# Altium schematic sheet ethernet.SchDoc (part 1 of 3)
size 420 x 297 mm; SheetNumber: 2; SheetTotal: 2
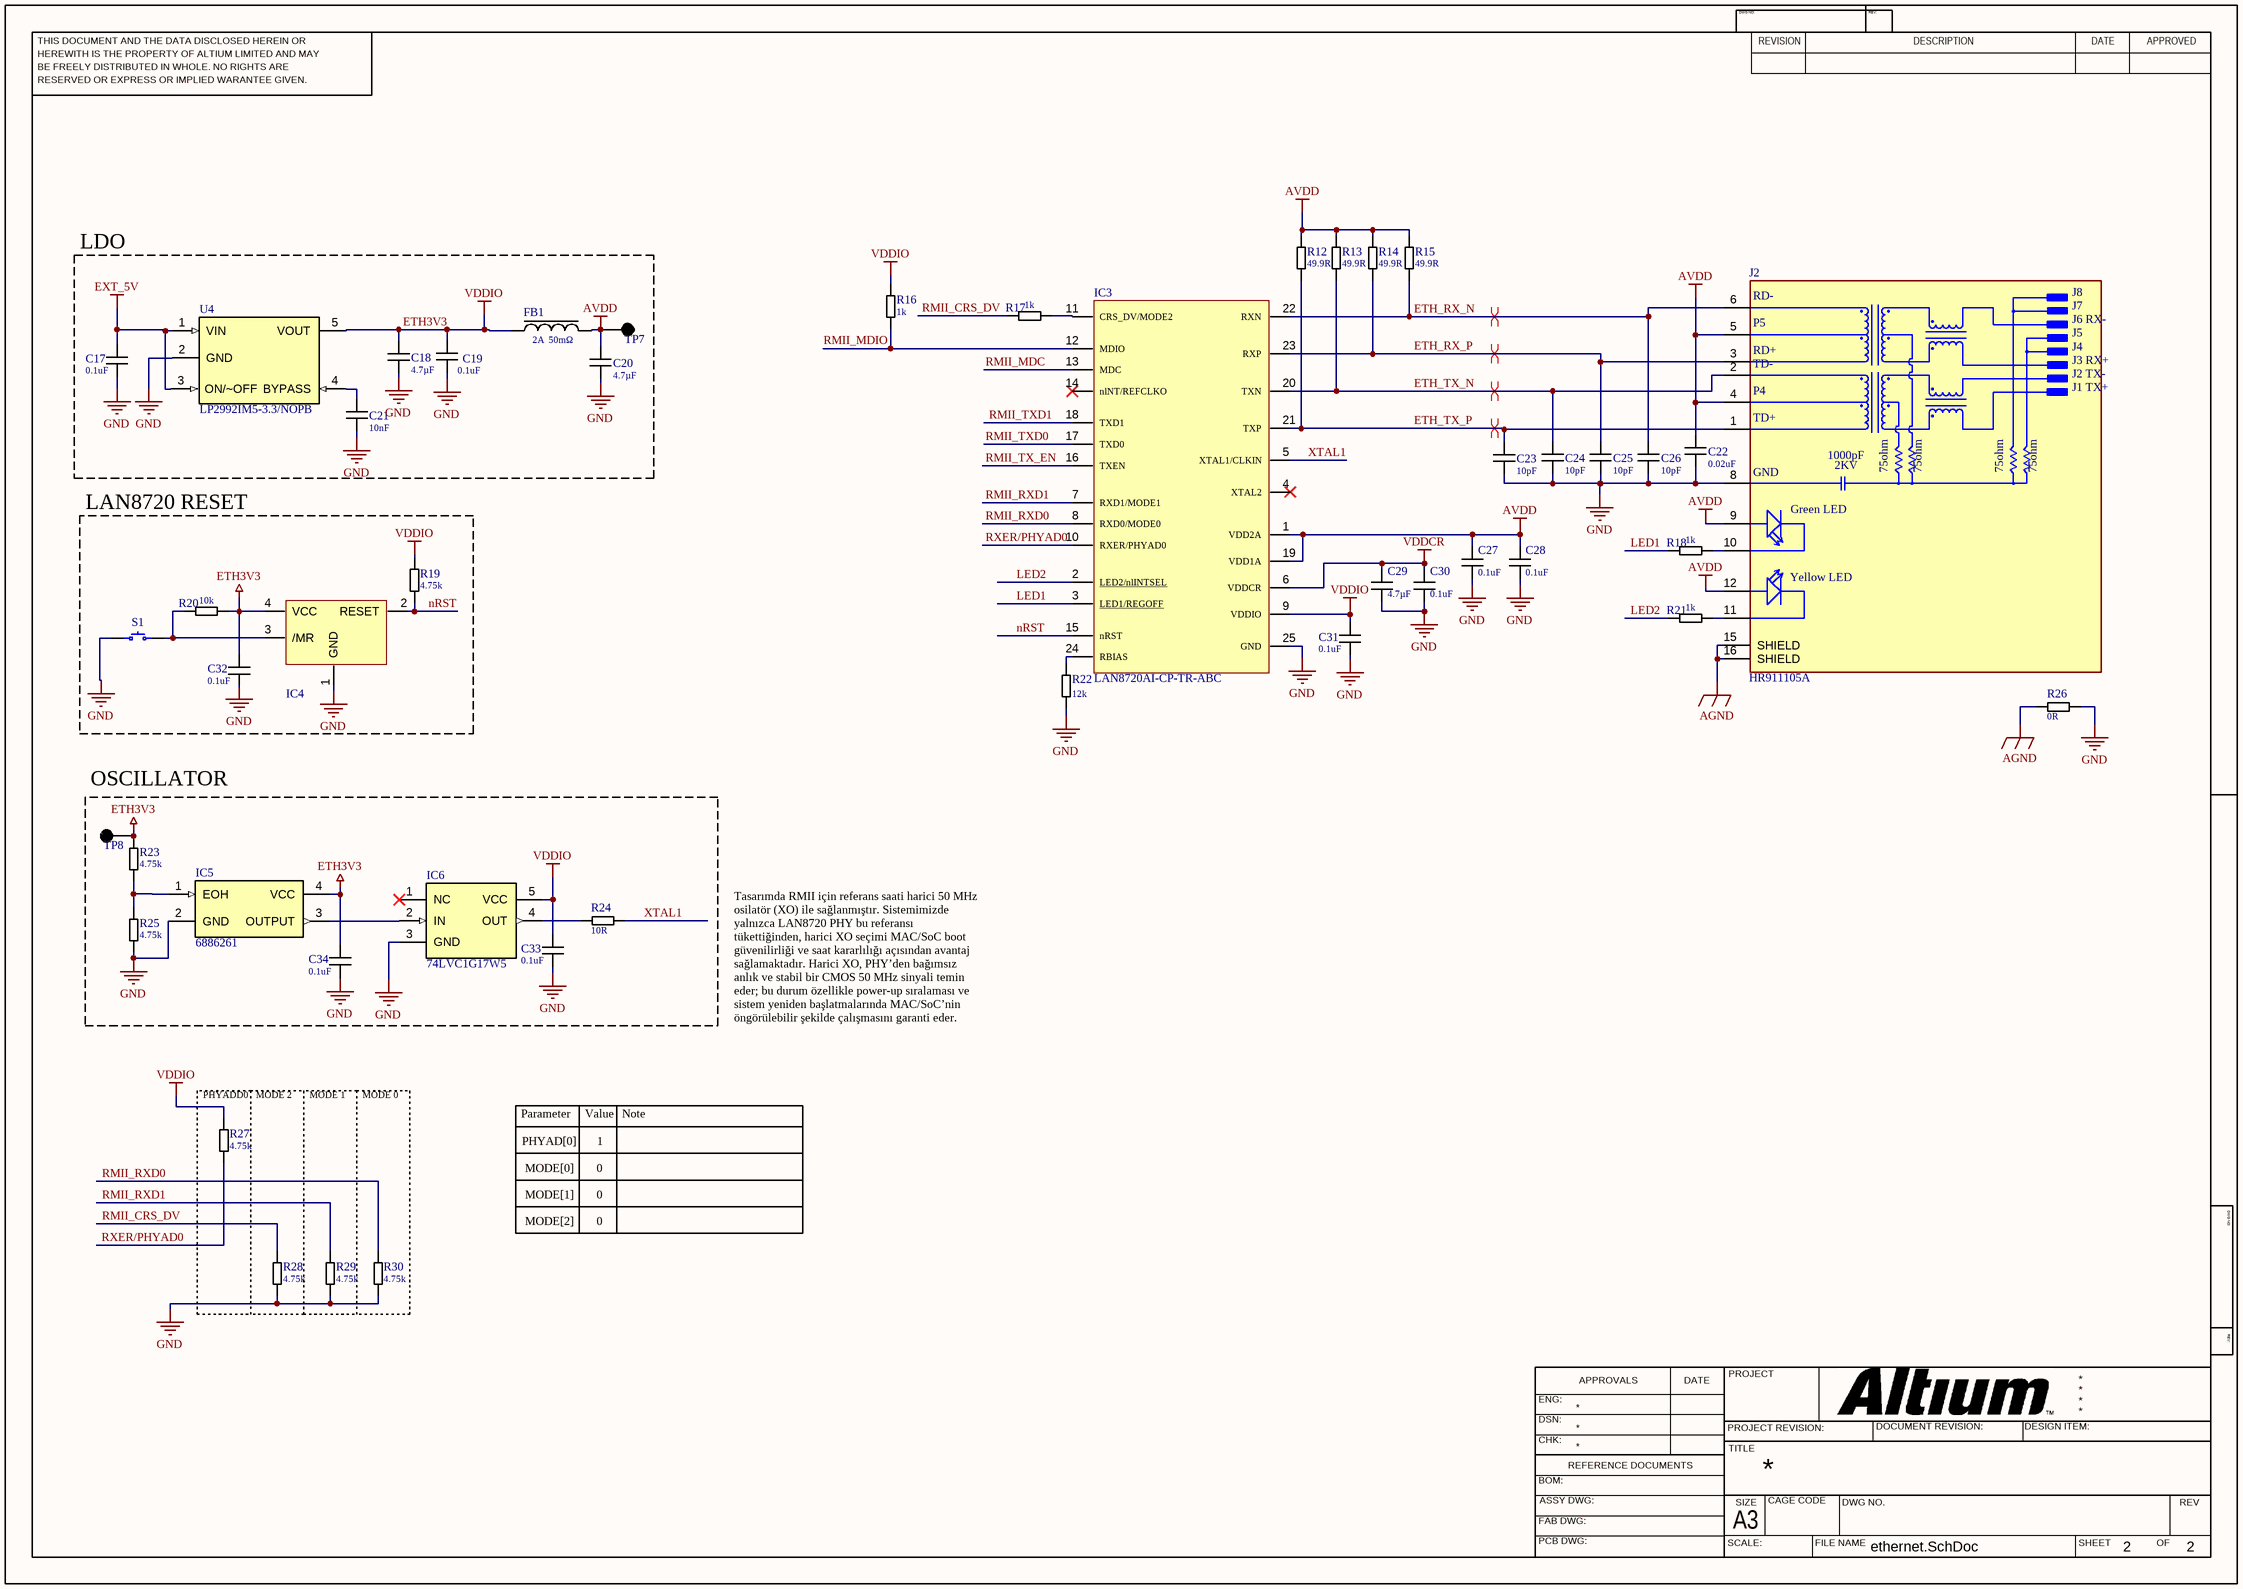
[diagram p0: ethernet.SchDoc]

## Parts
C17  Capacitance: 0.1uF  [CAP_0603]  (hidden comment: C0603C104K8RACTU)
C18  Capacitance: 4.7µF  [CAP_0603]  (hidden comment: CC0603KRX5R6BB475)
C19  Capacitance: 0.1uF  [CAP_0603]  (hidden comment: C0603C104K8RACTU)
C20  Capacitance: 4.7µF  [CAP_0603]  (hidden comment: CC0603KRX5R6BB475)
C21  Capacitance: 10nF  [CAP_0603]  (hidden comment: 06035C103MAZ2A)
C22  Capacitance: 0.02uF  [CAP_0603]  (hidden comment: KGM15AR71A223KT)
C23  Capacitance: 10pF  [CAP_0603]  (hidden comment: CC0603JRNPO9BN100)
C24  Capacitance: 10pF  [CAP_0603]  (hidden comment: CC0603JRNPO9BN100)
C25  Capacitance: 10pF  [CAP_0603]  (hidden comment: CC0603JRNPO9BN100)
C26  Capacitance: 10pF  [CAP_0603]  (hidden comment: CC0603JRNPO9BN100)
C27  Capacitance: 0.1uF  [CAP_0603]  (hidden comment: C0603C104K8RACTU)
C28  Capacitance: 0.1uF  [CAP_0603]  (hidden comment: C0603C104K8RACTU)
C29  Capacitance: 4.7µF  [CAP_0603]  (hidden comment: CC0603KRX5R6BB475)
C30  Capacitance: 0.1uF  [CAP_0603]  (hidden comment: C0603C104K8RACTU)
C31  Capacitance: 0.1uF  [CAP_0603]  (hidden comment: C0603C104K8RACTU)
C32  Capacitance: 0.1uF  [CAP_0603]  (hidden comment: C0603C104K8RACTU)
C33  Capacitance: 0.1uF  [CAP_0603]  (hidden comment: C0603C104K8RACTU)
C34  Capacitance: 0.1uF  [CAP_0603]  (hidden comment: C0603C104K8RACTU)
FB1  DC Resistance (DCR): 50mΩ  DC Current: 2A  [603_FB]  (hidden comment: BLM18PG121SN1D)
IC3  LAN8720AI-CP-TR-ABC  [QFN50P400X400X100-25N]
IC4  MIC6315-26D2UY-TR  [SOT190P237X118-4N]  (value not drawn)
IC5  Supplier Part Number 1: 6886261  [OSC_CB3LV-3I-50M000000]  (hidden comment: CB3LV-3I-50M000000)
IC6  74LVC1G17W5  [SOT95P280X145-5N]
J2  HR911105A  [HANRUN_HR911105A]
R12  Resistance: 49.9R  [RES_0603]  (hidden comment: ERJ-3EKF49R9V)
R13  Resistance: 49.9R  [RES_0603]  (hidden comment: ERJ-3EKF49R9V)
R14  Resistance: 49.9R  [RES_0603]  (hidden comment: ERJ-3EKF49R9V)
R15  Resistance: 49.9R  [RES_0603]  (hidden comment: ERJ-3EKF49R9V)
R16  value 1k  [RES_0603]  (hidden comment: RC0603FR-071KL)
R17  value 1k  [RES_0603]  (hidden comment: RC0603FR-071KL)
R18  value 1k  [RES_0603]  (hidden comment: RC0603FR-071KL)
R19  Resistance: 4.75k  [RES_0603]  (hidden comment: RC0603FR-074K75L)
R20  Resistance: 10k  [RES_0603]  (hidden comment: RC0603FR-0710KL)
R21  value 1k  [RES_0603]  (hidden comment: RC0603FR-071KL)
R22  value 12k  [RES_0603]  (hidden comment: RC0603JR-0712KL)
R23  Resistance: 4.75k  [RES_0603]  (hidden comment: RC0603FR-074K75L)
R24  Resistance: 10R  [RES_0603]  (hidden comment: RC0603JR-0710RL)
R25  Resistance: 4.75k  [RES_0603]  (hidden comment: RC0603FR-074K75L)
R26  Resistance: 0R  [RES_0603]  (hidden comment: RC0603JR-070RL)
R27  Resistance: 4.75k  [RES_0603]  (hidden comment: RC0603FR-074K75L)
R28  Resistance: 4.75k  [RES_0603]  (hidden comment: RC0603FR-074K75L)
R29  Resistance: 4.75k  [RES_0603]  (hidden comment: RC0603FR-074K75L)
R30  Resistance: 4.75k  [RES_0603]  (hidden comment: RC0603FR-074K75L)
S1  FSMSMTR  [TE FSMSMTR]  (value not drawn)
TP7  Test Point  [TP-5007]  (value not drawn)
TP8  Test Point  [TP-5007]  (value not drawn)
U4  LP2992IM5-3.3/NOPB  [SOT95P280X145-5N]

## Blocks framed on the sheet
LDO: C17-C21 FB1 TP7 U4
LAN8720 RESET: C32 IC4 R19 R20 S1
OSCILLATOR: C33 C34 IC5 IC6 R23-R25 TP8
PHYADD0: R27

## Nets
AGND: J2.15(SHIELD) J2.16(SHIELD) R26.1
AVDD: C20.2 C22.2 C27.2 C28.2 FB1.2 IC3.1(VDD2A) IC3.19(VDD1A) J2.4(P4) J2.5(P5) J2.9(GA) J2.12(YA) R12.2 R13.2 R14.2 R15.2 TP7.TP
ETH3V3: C18.2 C19.2 C31.2 C32.2 C33.2 C34.2 FB1.1 IC3.9(VDDIO) IC4.4(VCC) IC5.4(VCC) IC6.5(VCC) R16.1 R19.2 R20.2 R23.2 R27.2 TP8.TP U4.5(VOUT)  [also labelled VDDIO]
EXT_5V: C17.2 U4.1(VIN) U4.3(ON/~OFF)
GND: C17.1 C18.1 C19.1 C20.1 C21.1 C22.1 C23.1 C24.1 C25.1 C26.1 C27.1 C28.1 C29.1 C30.1 C31.1 C32.1 C33.1 C34.1 IC3.25(GND) IC4.1(GND) IC5.2(GND) IC6.3(GND) J2.8(GND) R22.1 R25.1 R26.2 R28.1 R29.1 R30.1 S1.1 U4.2(GND)
VDDCR: C29.2 C30.2 IC3.6(VDDCR)
ETH_RX_N: C26.2 IC3.22(RXN) J2.6(RD-) R15.1
ETH_RX_P: C25.2 IC3.23(RXP) J2.3(RD+) R14.1
ETH_TX_N: C24.2 IC3.20(TXN) J2.2(TD-) R13.1
ETH_TX_P: C23.2 IC3.21(TXP) J2.1(TD+) R12.1
LED1: IC3.3(LED1/REGOFF) R18.1
LED2: IC3.2(LED2/nlINTSEL) R21.1
nRST: IC3.15(nRST) IC4.2(RESET) R19.1
RMII_CRS_DV: R17.1 R28.2
RMII_MDC: IC3.13(MDC)
RMII_MDIO: IC3.12(MDIO) R16.2
RMII_RXD0: IC3.8(RXD0/MODE0) R30.2
RMII_RXD1: IC3.7(RXD1/MODE1) R29.2
RMII_TX_EN: IC3.16(TXEN)
RMII_TXD0: IC3.17(TXD0)
RMII_TXD1: IC3.18(TXD1)
RXER/PHYAD0: IC3.10(RXER/PHYAD0) R27.1
XTAL1: IC3.5(XTAL1/CLKIN) R24.2
NetC21_2: C21.2 U4.4(BYPASS)
NetIC3_11: IC3.11(CRS_DV/MODE2) R17.2
NetIC3_24: IC3.24(RBIAS) R22.2
NetIC4_3: IC4.3(/MR) R20.1 S1.2
NetIC5_1: IC5.1(EOH) R23.1 R25.2
NetIC5_3: IC5.3(OUTPUT) IC6.2(IN)
NetIC6_4: IC6.4(OUT) R24.1
NetJ2_10: J2.10(GC) R18.2
NetJ2_11: J2.11(YC) R21.2

Not connected (* = marked no-connect by the designer): IC3 4(XTAL2)* 14(nlNT/REFCLKO)*; IC6 1(NC)*

## Layout directives
differential pair: ETH_RX_N, ETH_RX_P, ETH_TX_N, ETH_TX_P

## Notes on the sheet
- Tasarımda RMII için referans saati harici 50 MHz osilatör (XO) ile sağlanmıştır. Sistemimizde yalnızca LAN8720 PHY bu referansı tükettiğinden, harici XO seçimi MAC/SoC boot güvenilirliği ve saat kararlılığı açısından avantaj sağlamaktadır. Harici XO, PHY’den bağımsız anlık ve stabil bir CMOS 50 MHz sinyali temin eder; bu durum özellikle power-up sıralaması ve sistem yeniden başlatmalarında MAC/SoC’nin öngörülebilir şekilde çalışmasını garanti eder.
- (near R27) MODE 2
- MODE 1
- MODE 0
- Parameter
- Value
- Note
- PHYAD[0]
- MODE[0]
- MODE[1]
- 0
- 1
- MODE[2]
- THIS DOCUMENT AND THE DATA DISCLOSED HEREIN OR
- HEREWITH IS THE PROPERTY OF ALTIUM LIMITED AND MAY
- DWG NO:
- REVISION
- REV:
- DESCRIPTION
- DATE
- APPROVED
- BE FREELY DISTRIBUTED IN WHOLE. NO RIGHTS ARE
- RESERVED OR EXPRESS OR IMPLIED WARANTEE GIVEN.
- ENG:
- APPROVALS
- PROJECT
- DSN:
- CHK:
- REFERENCE DOCUMENTS
- PROJECT REVISION:
- TITLE
- DOCUMENT REVISION:
- DESIGN ITEM:
- BOM:
- FAB DWG:
- PCB DWG:
- ASSY DWG:
- SCALE:
- A3
- SIZE
- CAGE CODE
- FILE NAME
- DWG NO.
- SHEET
- OF
- REV
- (in symbol HanRun - HR911105A) J8; J7; J6 RX-; J5; J4; J3 RX+; J2 TX-; J1 TX+; 1000pF; 2KV; 75ohm; Green LED; Yellow LED